# Altium schematic sheet [5]-CONNECTORS.SchDoc
size A4
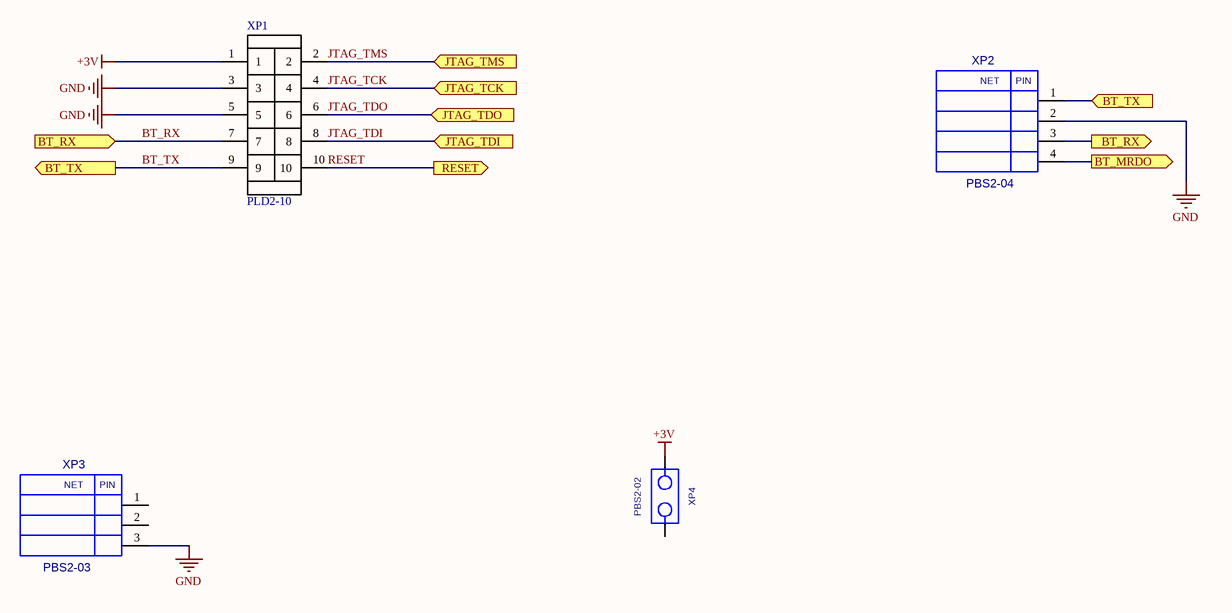
[diagram p0: [5]-CONNECTORS.SchDoc]

## Parts
XP1  PLD2-10  [PLD2-10]
XP2  PBS2-04  [PLS2-04]
XP3  PBS2-03  [PLS2-03]
XP4  PBS2-02  [PLS2-02]

## Ports
BT_MRDO (out), BT_RX (in), BT_RX (out), BT_TX (in), BT_TX (out), JTAG_TCK (in), JTAG_TDI (in), JTAG_TDO (in), JTAG_TMS (in), RESET (out)

## Nets
+3V: XP1.1 XP4.1
GND: XP1.3 XP1.5 XP2.2 XP3.3
BT_MRDO: XP2.4 ; port BT_MRDO
BT_RX: XP1.7 XP2.3 ; port BT_RX
BT_TX: XP1.9 XP2.1 ; port BT_TX
JTAG_TCK: XP1.4 ; port JTAG_TCK
JTAG_TDI: XP1.8 ; port JTAG_TDI
JTAG_TDO: XP1.6 ; port JTAG_TDO
JTAG_TMS: XP1.2 ; port JTAG_TMS
RESET: XP1.10 ; port RESET

Not connected (* = marked no-connect by the designer): XP3 1 2; XP4 2

## Notes on the sheet
- (in symbol PLS2-03) NET; PIN
- (in symbol PLS2-04) NET; PIN

## Library data of the parts
XP2 = PLS2-04: Value: *
XP3 = PLS2-03: Value: *
XP4 = PLS2-02: Value: *
XP1 = PLD2-10: Value: PLD2-10